# EAGLE design DisplayVolanteVE (EAGLE 9.6.2)

## Sheet 1 of 2
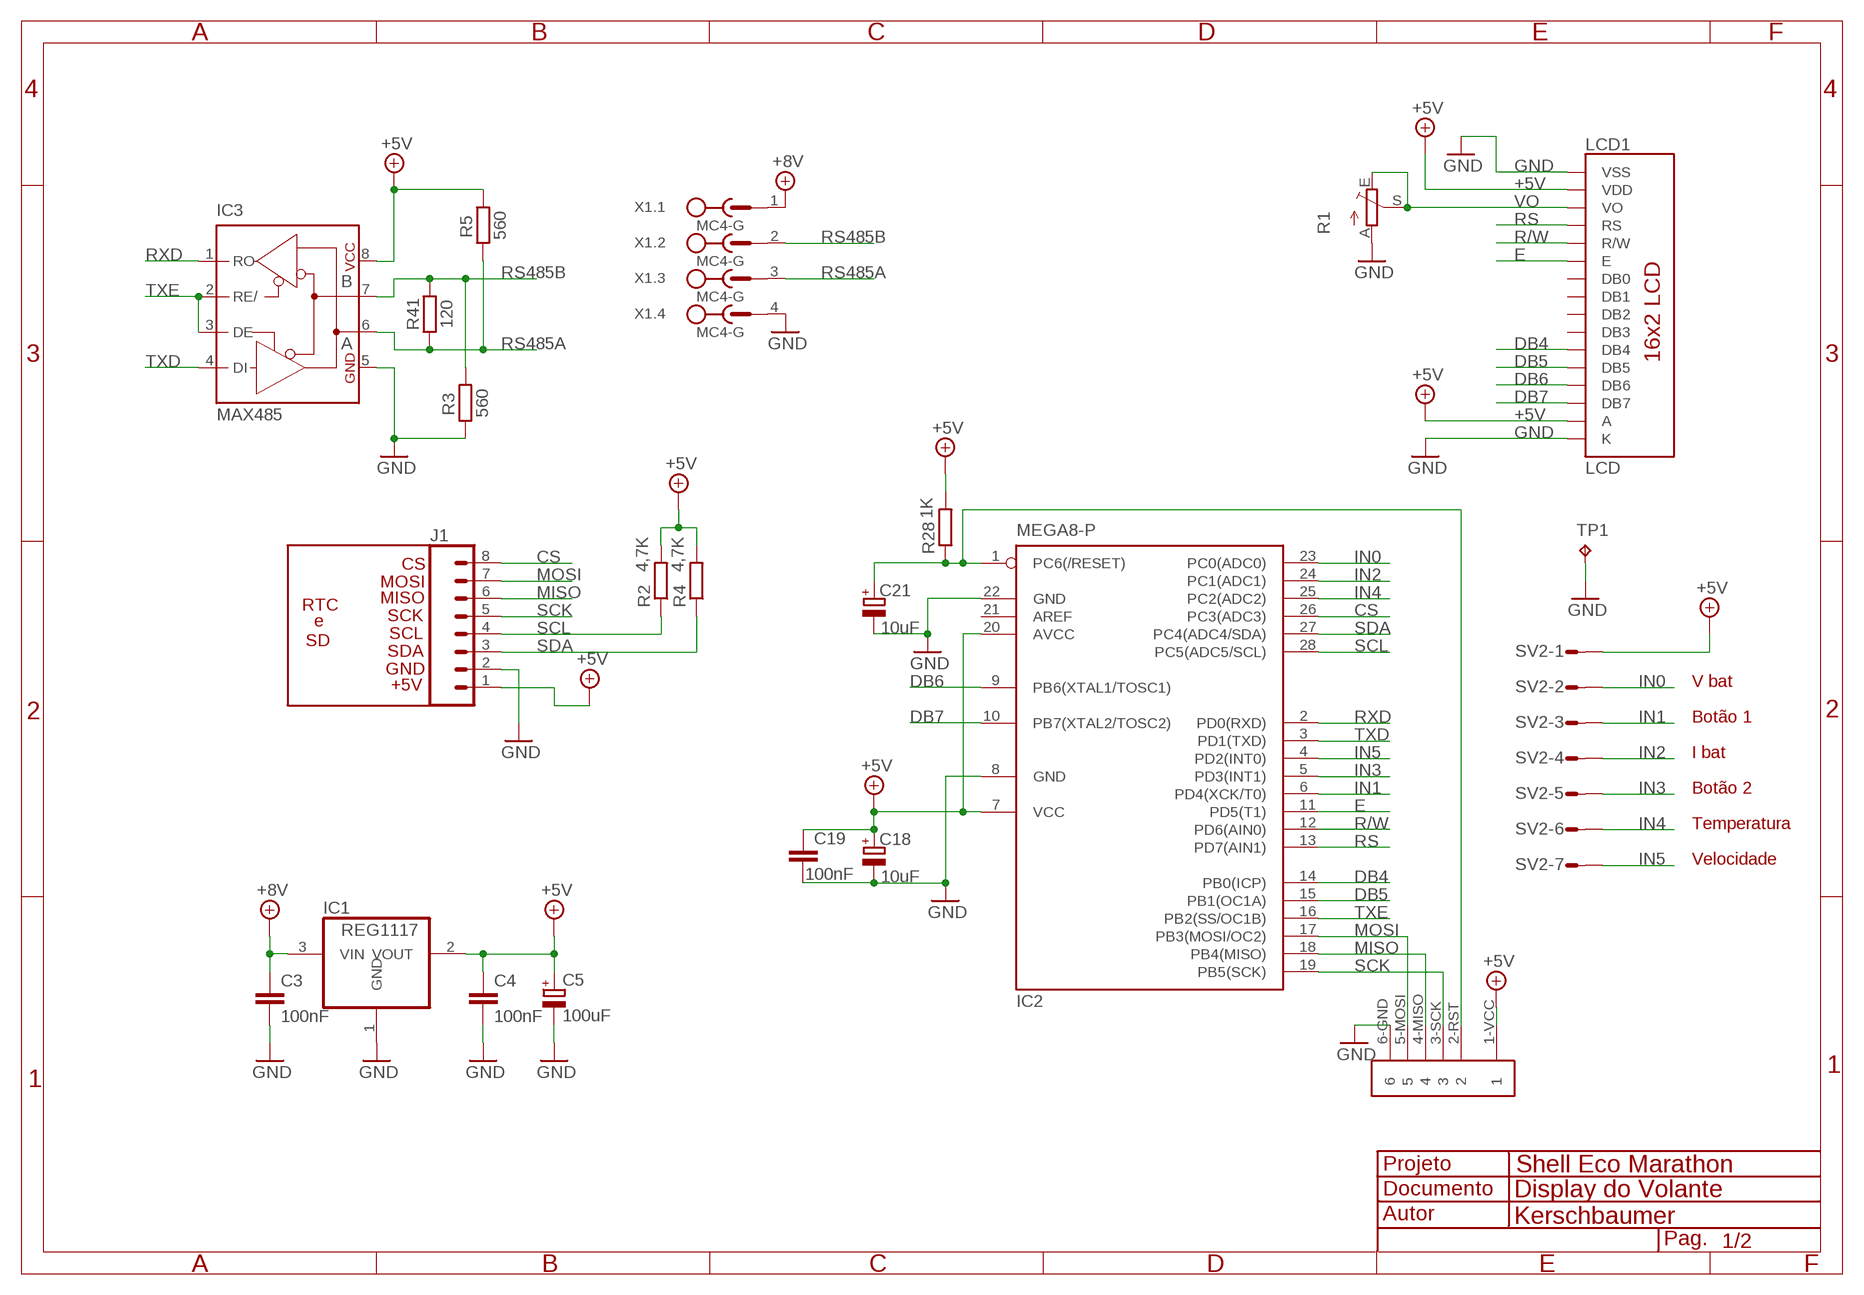
[diagram p0: schematic, sheet 1]

### Parts
C3  100nF  C-EU050-025X075  [C050-025X075]
C4  100nF  C-EU050-025X075  [C050-025X075]
C5  100uF  CPOL-EUE2.5-6  [E2,5-6]
C18  10uF  CPOL-EUE2.5-6  [E2,5-6]
C19  100nF  C-EU050-025X075  [C050-025X075]
C21  10uF  CPOL-EUE2.5-6  [E2,5-6]
IC1  REG1117  [SOT223]
IC2  MEGA8-P  [DIL28-3]
IC3  MAX485  [DIL08]
J1  CONN_08NO_SILK_FEMALE_PTH  [1X08_NO_SILK]
LCD1  LCD  LCD-16X2NOHOLES  [LCD-16X2_NOHOLESNOSILK]
P1  SPI  [SPI]
R1  TRIM_EU-B64Y  [B64Y]
R2  4,7K  R-EU_0207/7  [0207/7]
R3  560  R-EU_0207/7  [0207/7]
R4  4,7K  R-EU_0207/7  [0207/7]
R5  560  R-EU_0207/7  [0207/7]
R28  1K  R-EU_0207/7  [0207/7]
R41  120  R-EU_0207/7  [0207/7]
SV2  L07P  [L07P]
TP1  TPPAD1-13  [P1-13]
X1  MC4-G  [MC4-G]

### Nets
+5V: C4.1 C5.+ C18.+ C19.1 IC1.2(VOUT) IC2.7(VCC) IC2.20(AVCC) IC3.8(VCC) J1.1 LCD1.2(VDD) LCD1.15(A) P1.1-VCC R2.2 R4.2 R5.2 R28.2 SV2.1
+8V: C3.1 IC1.3(VIN) X1.1
CS: IC2.26(PC3(ADC3)) J1.8
DB4: IC2.14(PB0(ICP)) LCD1.11(DB4)
DB5: IC2.15(PB1(OC1A)) LCD1.12(DB5)
DB6: IC2.9(PB6(XTAL1/TOSC1)) LCD1.13(DB6)
DB7: IC2.10(PB7(XTAL2/TOSC2)) LCD1.14(DB7)
E: IC2.11(PD5(T1)) LCD1.6(E)
GND: C3.2 C4.2 C5.- C18.- C19.2 C21.- IC1.1(GND) IC2.8(GND) IC2.22(GND) IC3.5(GND) J1.2 LCD1.1(VSS) LCD1.16(K) P1.6-GND R1.A R3.1 TP1.TP X1.4
IN0: IC2.23(PC0(ADC0)) SV2.2
IN1: IC2.6(PD4(XCK/T0)) SV2.3
IN2: IC2.24(PC1(ADC1)) SV2.4
IN3: IC2.5(PD3(INT1)) SV2.5
IN4: IC2.25(PC2(ADC2)) SV2.6
IN5: IC2.4(PD2(INT0)) SV2.7
MISO: IC2.18(PB4(MISO)) J1.6 P1.4-MISO
MOSI: IC2.17(PB3(MOSI/OC2)) J1.7 P1.5-MOSI
N$8: C21.+ IC2.1(PC6(/RESET)) P1.2-RST R28.1
R/W: IC2.12(PD6(AIN0)) LCD1.5(R/W)
RS: IC2.13(PD7(AIN1)) LCD1.4(RS)
RS485A: IC3.6(A) R5.1 R41.1 X1.3
RS485B: IC3.7(B) R3.2 R41.2 X1.2
RXD: IC2.2(PD0(RXD)) IC3.1(RO)
SCK: IC2.19(PB5(SCK)) J1.5 P1.3-SCK
SCL: IC2.28(PC5(ADC5/SCL)) J1.4 R2.1
SDA: IC2.27(PC4(ADC4/SDA)) J1.3 R4.1
TXD: IC2.3(PD1(TXD)) IC3.4(DI)
TXE: IC2.16(PB2(SS/OC1B)) IC3.2(RE/) IC3.3(DE)
VO: LCD1.3(VO) R1.E R1.S
Unconnected: IC2.21(AREF) LCD1.7(DB0) LCD1.8(DB1) LCD1.9(DB2) LCD1.10(DB3)

### Notes on the sheet
- CS
- MOSI
- MISO
- RTC
- SCK
- e
- SCL
- SD
- SDA
- GND
- +5V | V bat
- Botão 1
- I bat
- Botão 2
- Temperatura
- Velocidade
- Shell Eco Marathon
- Display do Volante
- Kerschbaumer

## Sheet 2 of 2
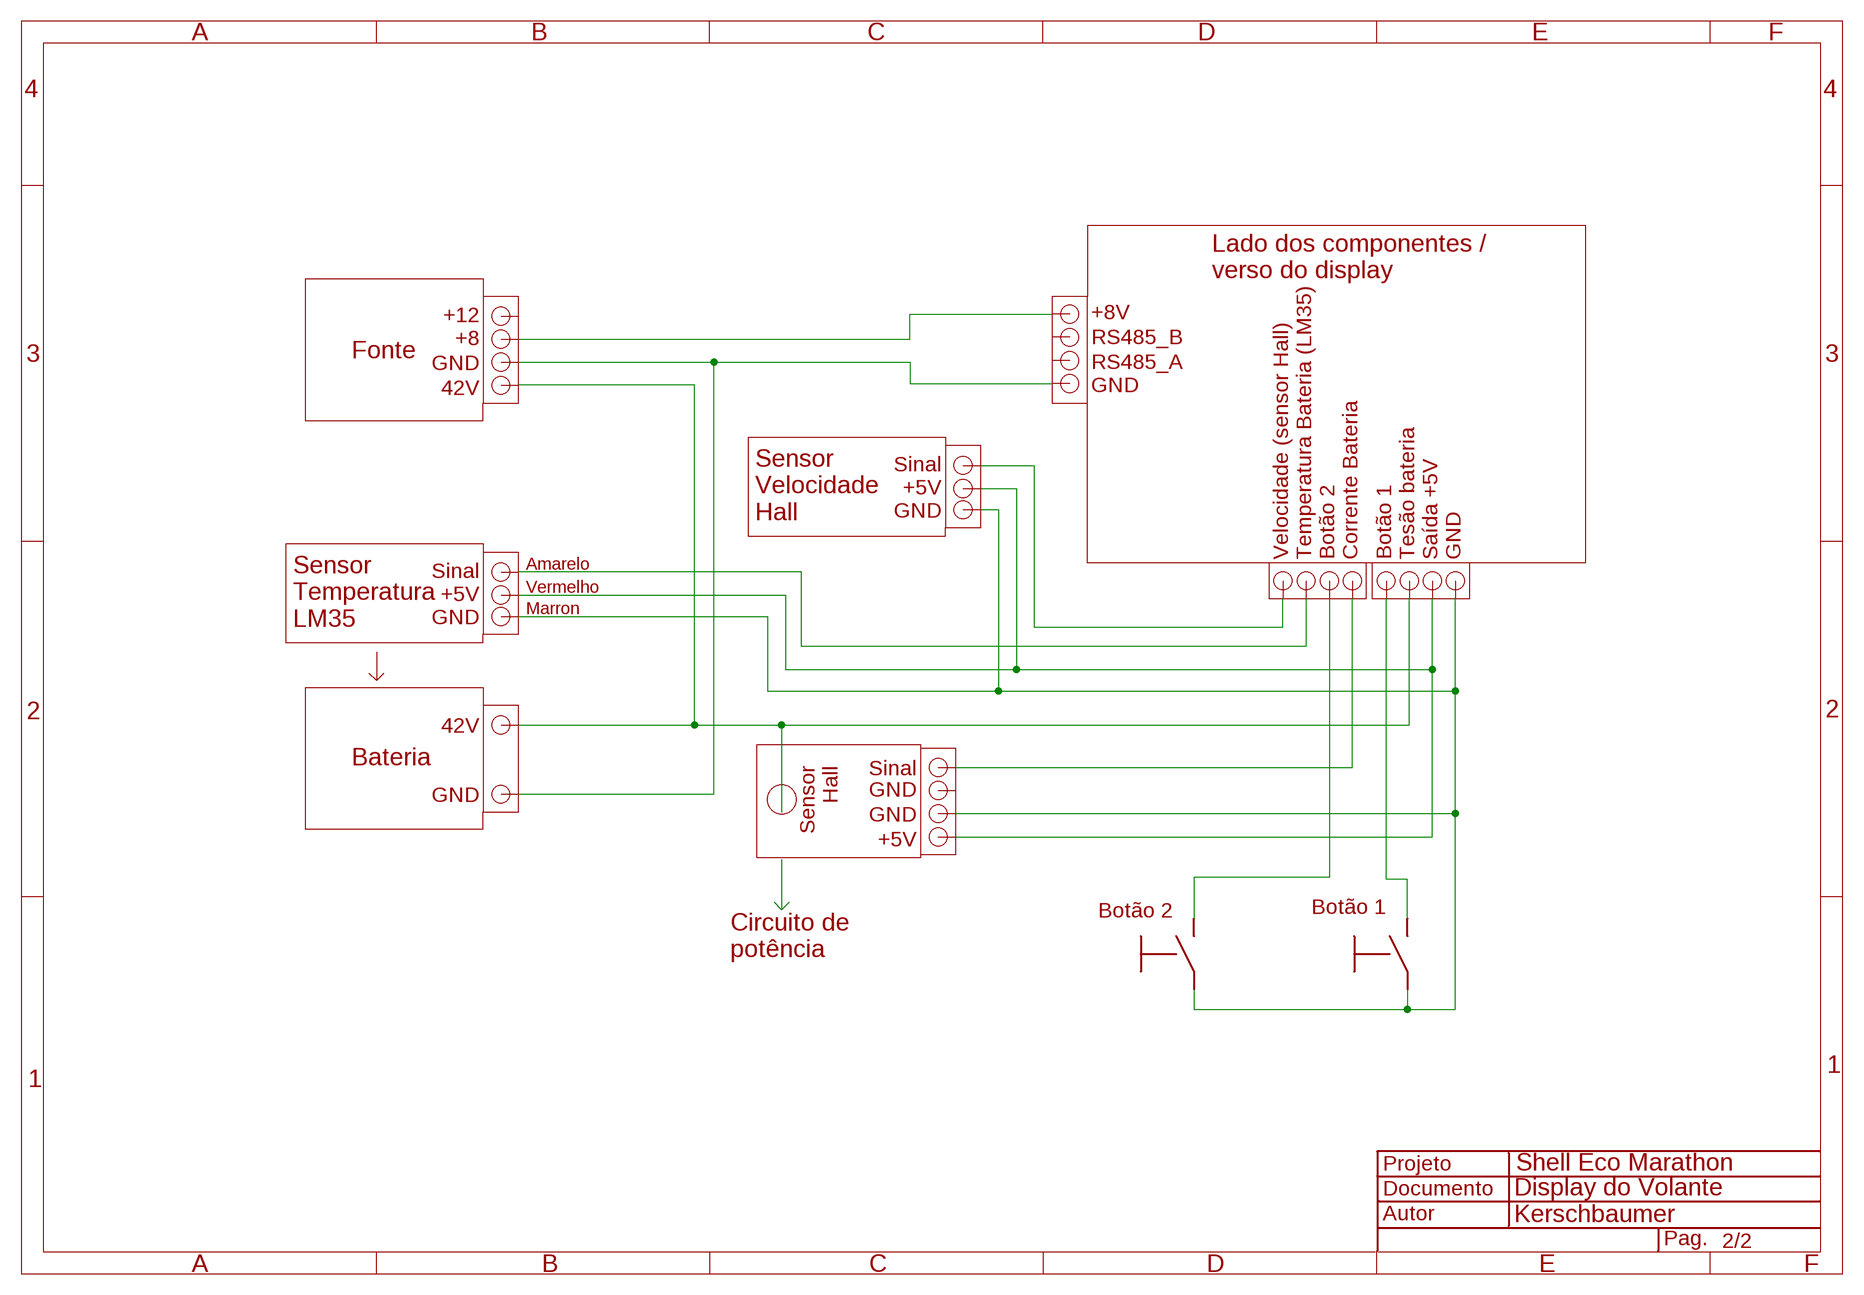
[diagram p1: schematic, sheet 2]

### Notes on the sheet
- Lado dos componentes /
  verso do display
- +12
- +8V
- +8
- RS485_B
- Fonte | GND
- RS485_A
- 42V
- GND
- Sinal
- +5V
- GND
- Sensor
  Velocidade
  Hall
- Sinal | Velocidade (sensor Hall) | Temperatura Bateria (LM35) | Botão 2 | Corrente Bateria | Botão 1 | Tesão bateria | Saída +5V | GND
- Amarelo
- +5V
- Vermelho
- GND
- Marron
- Sensor
  Temperatura
  LM35
- 42V
- Bateria | Sinal
- Sensor
  Hall
- GND | GND
- GND
- +5V
- Botão 2 | Botão 1
- Circuito de
  potência
- Shell Eco Marathon
- Display do Volante
- Kerschbaumer

## Library data of the parts
C3 C4 C19 = rcl:C-EU: CAPACITOR, European symbol; SPICEPREFIX: C
C5 C18 C21 = rcl:CPOL-EU: POLARIZED CAPACITOR, European symbol; SPICEPREFIX: C
IC1 = burr-brown:REG1117: 800mA and 1A Low Dropout (LDO) Positive Regulator 1.8V, 2.5V, 2.85V, 3.3V, 5V, and Adj; MPN: REG1117; OC_FARNELL: 1097566; OC_NEWARK: 14P6981
IC2 = atmel:MEGA8-P: MICROCONTROLLER 8 Kbytes FLASH, 1 kbytes SRAM, 512 bytes EEPROM, USART, 4-channel 10 bit ADC, 2-channel 8 bit ADC Pin compatible with Atmega48, ATMega88, ATMega168 Source: avr.lbr; OC_FARNELL: unknown; OC_NEWARK: unknown
IC3 = ,RK_outros:MAX485
J1 = SparkFun-Connectors:CONN_08: Multi connection point. Often used as Generic Header-pin footprint for 0.1 inch spaced/style header connections On any of the 0.1 inch spaced packages, you can populate with these: Break Away Headers - Straight <https://www.sparkfun.com/products/116> (PRT-00116) Break Away Male Headers - Right Angle <https://www.sparkfun.com/products/553> (PRT-00553) Female Headers <https://www.sparkfun.com/products/115> (PRT-00115) Break Away Headers - Machine Pin <https://www.sparkfun.com/products/117> (PRT-00117) Break Away Female Headers - Swiss Machine Pin <https://www.sparkfun.com/products/743> (PRT-00743) Arduino Stackable Header - 8 Pin <https://www.sparkfun.com/products/9279> (PRT-09279) For SCREWTERMINALS and SPRING TERMINALS visit here: Screw Terimnals on SparkFun.com <https://www.sparkfun.com/search/results?term=Screw+Terminals> (5mm/3.5mm/2.54mm spacing) This device is also useful as a general connection point to wire up your design to another part of your project. Our various solder wires solder well into these plated through hole pads. Hook-Up Wire - Assortment (Stranded, 22 AWG) <https://www.sparkfun.com/products/11375> (PRT-11375) Hook-Up Wire - Assortment (Solid Core, 22 AWG) <https://www.sparkfun.com/products/11367> (PRT-11367) View the entire wire category on our website here <https://www.sparkfun.com/categories/141> Special notes: Molex polarized connector foot print use with SKU : PRT-08231 with associated crimp pins and housings. 1MM SMD Version SKU: PRT-10208 NOTES ON THE VARIANTS LOCK and LOCK_LONGPADS... This footprint was designed to help hold the alignment of a through-hole component (i.e. 6-pin header) while soldering it into place. You may notice that each hole has been shifted either up or down by 0.005 of an inch from it's more standard position (which is a perfectly straight line). This slight alteration caused the pins (the squares in the middle) to touch the edges of the holes. Because they are alternating, it causes a "brace" to hold the component in place. 0.005 has proven to be the perfect amount of "off-center" position when using our standard breakaway headers. Although looks a little odd when you look at the bare footprint, once you have a header in there, the alteration is very hard to notice. Also,if you push a header all the way into place, it is covered up entirely on the bottom side.; PROD_ID: CONN-08438
LCD1 = SparkFun-Displays:LCD-16X2: Standard text-only 16x2 parallel input LCD Basic 16 character by 2 line display. Typically utilizes the extremely common HD44780 parallel interface chipset SparkFun Products: Basic 16x2 Green <https://www.sparkfun.com/products/255> Basic 8x2 Green <https://www.sparkfun.com/products/11122>; SF_ID: LCD-00255
P1 = ,RK_outros:SPI
R1 = pot:TRIM_EU-: POTENTIOMETER
R2-R5 R28 R41 = rcl:R-EU_: RESISTOR, European symbol; SPICEPREFIX: R
SV2 = ,RK_Conectores:L07P: AMP MT CONNECTOR
TP1 = testpad:TP: Test pad
X1 = con-phoenix-381_l:MC4-G: Mini-Combicon 3.81mm horizontal 4-polig MC 1,5/4-G-3,81 Artikel-Nr. 1803293 mit Gegenstecker MC 1,5/4-ST-3,81 Artikel-Nr. 1803594

## Board
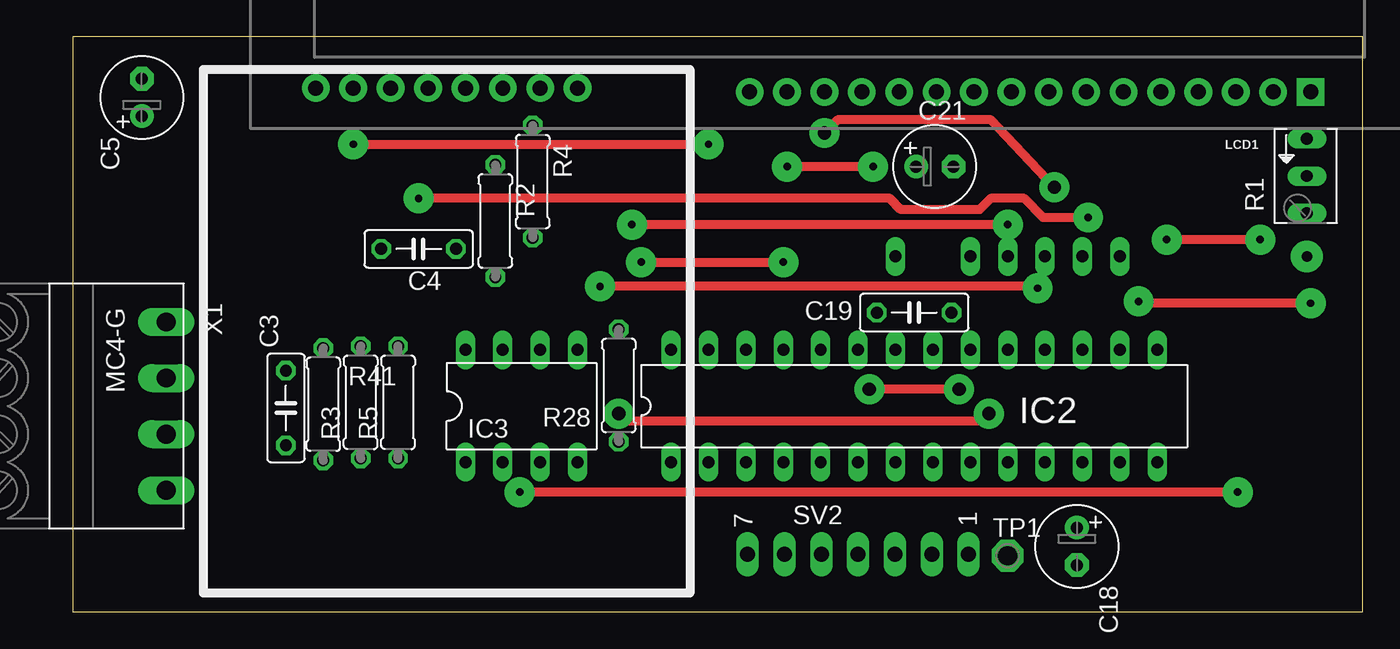
[diagram p2: board, top side]
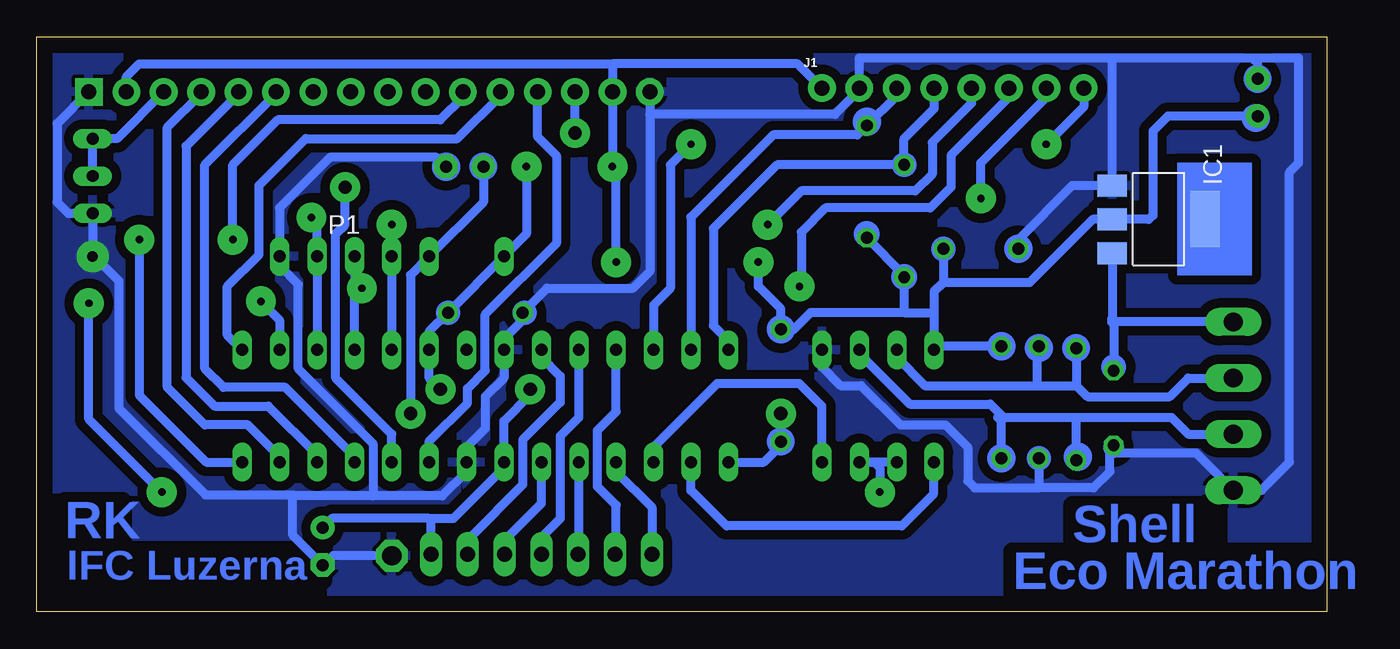
[diagram p3: board, bottom side, seen from below]

Size 87.61 x 39.04 mm. Coordinates in mm from the lower left corner, seen from the top.
Outline: 0,0 87.61,0 87.61,39.04 0,39.04 0,0
Copper layers (1*16): Top 0.035mm / dielectric 1.5mm / Bottom 0.035mm
Design rules "default *": minimum track width 6mil, minimum drill 0.35mm, track to track 25mil, track to pad 25mil, pad to pad 25mil, via to via 25mil, smd to smd 6mil, copper to edge 40mil, drill to drill 16mil, minimum pad ring 10mil, minimum via ring 8mil, stop-mask expansion 4mil, vias tented up to drill 0mil, thermal gap 10mil
bRestrict: area 10.5,23 to 11.8,25.5; area 11.8,23 to 13.1,25.5

### Footprints (pad centres in the part's own frame; a part is rotated, then mirrored left to right if it is on the bottom)
C050-025X075 = drill 0.813 octagon: 1 -2.54,0; 2 2.54,0
E2,5-6 = drill 0.813 pad 1.6: + -1.27,0 | drill 0.813 pad 1.6 octagon: - 1.27,0
SOT223 = smd 1.499 x 2.007: 1 -2.261,-3.15; 2 0.025,-3.15; 3 2.311,-3.15 | smd 3.81 x 2.007: 4 0,3.15
DIL28-3 = drill 0.813 long: 1 -16.51,-3.81; 2 -13.97,-3.81; 3 -11.43,-3.81; 4 -8.89,-3.81; 5 -6.35,-3.81; 6 -3.81,-3.81; 7 -1.27,-3.81; 8 1.27,-3.81; 9 3.81,-3.81; 10 6.35,-3.81; 11 8.89,-3.81; 12 11.43,-3.81; 13 13.97,-3.81; 14 16.51,-3.81; 15 16.51,3.81; 16 13.97,3.81; 17 11.43,3.81; 18 8.89,3.81; 19 6.35,3.81; 20 3.81,3.81; 21 1.27,3.81; 22 -1.27,3.81; 23 -3.81,3.81; 24 -6.35,3.81; 25 -8.89,3.81; 26 -11.43,3.81; 27 -13.97,3.81; 28 -16.51,3.81
DIL08 = drill 0.813 long: 1 -3.81,-3.81; 2 -1.27,-3.81; 3 1.27,-3.81; 4 3.81,-3.81; 5 3.81,3.81; 6 1.27,3.81; 7 -1.27,3.81; 8 -3.81,3.81
1X08_NO_SILK = drill 1.016 pad 1.88: 1 0,0; 2 2.54,0; 3 5.08,0; 4 7.62,0; 5 10.16,0; 6 12.7,0; 7 15.24,0; 8 17.78,0
LCD-16X2_NOHOLESNOSILK = drill 1.016 pad 1.88 square: 1 -32,15.5 | drill 1.016 pad 1.88: 2 -29.46,15.5; 3 -26.92,15.5; 4 -24.38,15.5; 5 -21.84,15.5; 6 -19.3,15.5; 7 -16.76,15.5; 8 -14.22,15.5; 9 -11.68,15.5; 10 -9.14,15.5; 11 -6.6,15.5; 12 -4.06,15.5; 13 -1.52,15.5; 14 1.02,15.5; 15 3.56,15.5; 16 6.1,15.5
SPI = drill 0.813 long: 1-VCC -7.62,0; 2-RST -2.54,0; 3-SCK 0,0; 4-MISO 2.54,0; 5-MOSI 5.08,0; 6-GND 7.62,0
B64Y = drill 0.813 long: A 2.54,0; E -2.54,0; S 0,0
0207/7 = drill 0.813 octagon: 1 -3.81,0; 2 3.81,0
L07P = drill 1.016 long: 1 7.5,-2.44; 2 5,-2.44; 3 2.5,-2.44; 4 0,-2.44; 5 -2.5,-2.44; 6 -5,-2.44; 7 -7.5,-2.44
P1-13 = drill 1.321 pad 2.159 octagon: TP 0,0
MC4-G = drill 1.27 long: 1 -5.715,0; 2 -1.905,0; 3 1.905,0; 4 5.715,0

### Placement (x,y rotation side)
C3  14.48,13.84 270 top
C4  23.49,24.64 180 top
C5  4.7,34.92 90 top
C18  68.2,4.45 270 top
C19  57.15,20.32 180 top
C21  58.55,30.23 0 top
IC1  11.43,26.67 270 bottom
IC2  57.15,13.97 0 top
IC3  30.48,13.97 0 top
J1  34.29,35.56 0 bottom
LCD1  52.07,50.8 180 top
P1  63.5,24.13 180 bottom
R1  83.82,29.59 270 top
R2  28.7,26.54 270 top
R3  19.56,14.22 90 top
R4  31.24,29.21 270 top
R5  22.1,14.22 90 top
R28  37.08,15.37 90 top
R41  17.02,14.1 90 top
SV2  53.34,6.35 0 top
TP1  63.5,3.81 0 top
X1  6.35,13.97 270 top

### Tracks (layer width: path | path; a pad name or v marks a point on that pad's centre or on a via)
+5V  (via drill 0.5 pad 2.03, 0.9 pad 2.03)
  Top 0.61: v60.2,15.11 v54.1,15.11 | v54.36,30.23 v48.51,30.23 | v38.61,23.75 v48.26,23.75
  Bottom 0.61: v54.1,15.11 54.1,14.73 55.88,12.95 IC2.7 55.88,9.78 59.31,6.35 60.96,6.35 | v60.2,15.11 60.96,15.88 IC2.20 60.96,19.05 C19.1 P1.1-VCC 54.36,25.65 v54.36,30.23 | LCD1.2 81.53,36.33 80.64,37.21 48.51,37.21 | 48.51,37.21 LCD1.15 v48.51,30.23 48.51,29.59 48.26,29.34 v48.26,23.75 | 48.51,37.21 35.94,37.21 J1.1 | 28.7,20.32 35.05,20.32 36.2,19.18 R28.2 37.08,20.57 38.61,22.1 v38.61,23.75 | 26.05,22.35 20.19,22.35 15.9,26.65 IC1.2 12.09,26.65 11.81,26.92 11.81,32.64 10.79,33.66 C5.+ | 26.05,22.35 26.67,21.74 26.67,20.32 | 26.67,20.32 IC3.8 26.42,18.03 R5.2 | C4.1 26.04,22.37 26.05,22.35 | 28.7,20.32 R2.2 28.7,22.86 R4.2 | 28.7,20.32 26.67,20.32 | SV2.1 60.84,6.23 60.96,6.35 | C18.+ 67.56,6.35 60.96,6.35
+8V
  Bottom 0.61: C3.1 14.48,19.56 14.61,19.69 | IC1.3 14.58,19.91 14.61,19.89 14.61,19.69 | X1.1 14.61,19.69
CS  (via drill 0.5 pad 2.03)
  Top 0.61: v19.05,31.75 v43.18,31.75
  Bottom 0.61: v19.05,31.75 16.51,34.29 J1.8 | IC2.26 45.72,20.83 44.58,21.97 44.58,30.35 v43.18,31.75
DB4  (via drill 0.5 pad 2.03)
  Top 0.61: v80.64,25.27 v74.3,25.27
  Bottom 0.61: v74.3,25.27 74.3,30.35 71.25,33.4 60.2,33.4 58.67,34.93 LCD1.11 | IC2.14 76.09,10.16 80.64,14.71 v80.64,25.27
DB5
  Bottom 0.61: IC2.15 74.68,18.8 74.68,22.1 72.52,24.26 72.52,28.96 69.34,32.13 59.05,32.13 56.13,35.06 LCD1.12
DB6
  Bottom 0.61: IC2.9 60.96,11.59 58.37,14.18 58.37,15.16 57.15,16.38 57.15,20.19 52.32,25.02 52.32,30.98 53.59,32.25 LCD1.13
DB7  (via drill 0.9 pad 2.03)
  Top 0.61: v51.05,32.51 51.94,33.4 62.36,33.4 v66.67,28.83
  Bottom 0.61: IC2.10 63.5,12.07 67.31,15.88 67.31,25.65 66.67,26.29 v66.67,28.83 | v51.05,32.51 LCD1.14
E
  Bottom 0.61: IC2.11 66.04,10.54 70.74,15.24 74.93,15.24 76.2,16.51 76.2,30.35 71.37,35.18 LCD1.6
GND  (via drill 0.7 pad 2.16)
  Bottom 0.61: 64.77,7.87 64.77,11.43 69.85,16.51 69.85,22.23 71.12,23.5 P1.6-GND 71.12,27.43 67.69,30.86 60.45,30.86 C21.- | LCD1.1 86.23,33.15 86.23,27.81 85.47,27.05 R1.A 83.82,24.26 82.04,22.48 82.04,13.84 76.16,7.95 70.23,7.95 | 64.77,7.87 60.07,7.87 58.42,9.53 IC2.8 58.42,11.18 57.15,12.45 57.15,14.61 55.88,15.88 IC2.22 55.88,18.54 54.36,20.07 C19.2 52.96,21.97 47.12,21.97 45.97,23.12 45.97,33.78 | 14.73,37.62 31.75,37.62 J1.2 31.75,35.43 33.4,33.78 45.97,33.78 | 14.73,37.62 5.08,37.62 | 5.08,37.62 1.91,37.62 1.91,30.48 2.54,29.84 2.54,10.16 4.45,8.26 X1.4 8.89,10.8 13.97,10.8 | LCD1.16 45.97,33.78 | 19.56,8.42 15.84,8.42 14.73,9.53 14.73,10.8 13.97,10.8 | 13.97,10.8 C3.2 | C4.2 20.95,25.27 17.3,28.93 IC1.1 14.58,37.47 14.73,37.62 | R3.1 19.56,8.42 | TP1.TP 63.53,3.84 67.46,3.84 68.12,3.18 C18.- 70.23,5.21 70.23,7.95 | IC3.5 34.29,16.64 33.02,15.37 31.62,15.37 28.96,12.7 25.91,12.7 24.38,11.18 24.38,8.89 23.91,8.42 19.56,8.42 | 5.08,37.62 4.7,37.24 C5.- | 64.77,7.87 70.16,7.87 70.23,7.95
  other vias: 83.82,24.13
  pour Bottom: 1.27,38.1 1.27,1.27 86.36,1.27 86.36,38.1
IN0
  Bottom 0.61: IC2.23 53.34,17.27 52.07,16 52.07,14.22 54.61,11.68 54.61,8.64 58.17,5.08 58.42,5.08 58.42,3.99 SV2.2
IN1
  Bottom 0.61: SV2.3 55.84,4.87 53.34,7.37 IC2.6
IN2
  Bottom 0.61: SV2.4 53.34,5.05 52.07,6.32 52.07,11.94 50.8,13.21 IC2.24
IN3
  Bottom 0.61: SV2.5 50.8,3.95 IC2.5
IN4
  Bottom 0.61: IC2.25 48.26,13.59 49.53,12.32 49.53,8.51 48.26,7.24 48.26,3.99 SV2.6
IN5
  Bottom 0.61: IC2.4 48.26,9.53 45.84,7.11 SV2.7
MISO  (via drill 0.5 pad 2.03)
  Top 0.61: v65.53,21.97 65.53,22.1 v35.81,22.1
  Bottom 0.61: J1.6 21.59,34.92 25.53,30.99 25.53,28.83 26.92,27.43 34.04,27.43 35.69,25.78 35.69,22.23 v35.81,22.1 | 66.04,22.48 v65.53,21.97 | IC2.18 66.04,22.48 | P1.4-MISO 66.04,22.48
MOSI  (via drill 0.5 pad 2.03)
  Top 0.61: v68.96,26.77 65.91,26.77 64.62,28.07 62.36,28.07 61.59,27.31 56.26,27.31 55.5,28.07 v23.49,28.07
  Bottom 0.61: IC2.17 P1.5-MOSI 68.58,26.39 v68.96,26.77 | v23.49,28.07 23.49,30.48 19.05,34.92 J1.7
N$8  (via drill 0.9 pad 2.03)
  Top 0.61: v62.23,13.46 61.72,12.95 37.59,12.95 v37.08,13.46
  Bottom 0.61: v62.23,13.46 62.23,22.86 P1.2-RST 57.28,27.81 C21.+ | v37.08,13.46 R28.1 37.08,11.3 38.23,10.16 IC2.1
R/W
  Bottom 0.61: IC2.12 68.58,10.67 71.88,13.97 75.53,13.97 77.47,15.91 77.47,31.62 73.91,35.18 LCD1.5
RS
  Bottom 0.61: IC2.13 71.12,10.54 73.28,12.7 76.2,12.7 78.74,15.24 78.74,32.89 76.45,35.18 LCD1.4
RS485A
  Bottom 0.61: IC3.6 31.75,17.53 28.32,14.1 22.86,14.1 21.97,13.21 | R41.1 17.02,13.21 | 21.97,13.21 22.35,13.21 22.1,12.95 R5.1 | 21.97,13.21 17.02,13.21 | 17.02,13.21 10.55,13.21 9.4,12.07 X1.3
RS485B
  Bottom 0.61: IC3.7 29.21,17.27 27.3,15.37 19.68,15.37 | 19.68,15.37 17.02,15.37 | R41.2 17.02,15.37 | 17.02,15.37 16.26,14.61 10.68,14.61 9.4,15.88 X1.2 | R3.2 19.68,17.91 19.68,15.37
RXD
  Bottom 0.61: IC2.2 43.18,8.26 40.77,5.84 28.86,5.84 26.72,7.98 26.72,10.11 IC3.1
SCK  (via drill 0.5 pad 2.03)
  Top 0.61: v63.5,26.29 v37.97,26.29
  Bottom 0.61: IC2.19 P1.3-SCK v63.5,26.29 | J1.5 24.13,34.54 26.8,31.88 26.8,29.72 27.94,28.58 35.69,28.58 v37.97,26.29
SCL
  Bottom 0.61: J1.4 26.67,34.16 28.7,32.13 R2.1 37.34,30.35 41.66,26.03 41.66,19.43 40.64,18.42 IC2.28
SDA
  Bottom 0.61: J1.3 29.21,35.05 R4.1 31.88,32.39 37.59,32.39 43.18,26.8 IC2.27
TXD
  Bottom 0.61: IC3.4 34.29,13.97 35.81,15.49 41.4,15.49 45.72,11.18 IC2.3
TXE  (via drill 0.5 pad 2.03)
  Top 0.61: v79.12,8.13 v30.35,8.13 | v84.07,20.96 72.52,20.96 v72.39,21.08
  Bottom 0.61: IC3.2 IC3.3 30.73,10.16 30.35,9.78 v30.35,8.13 | v79.12,8.13 84.07,13.08 v84.07,20.96 | v72.39,21.08 71.12,19.81 IC2.16
VO
  Bottom 0.61: R1.S R1.E 82.16,32.13 LCD1.3
(copper drawn outside any net)
  shapes: Bottom area x1, Bottom circle x22

### Text on the board
Bottom: Shell | RK | IFC Luzerna | Eco Marathon